# EAGLE design schematic (EAGLE 9.6.2)
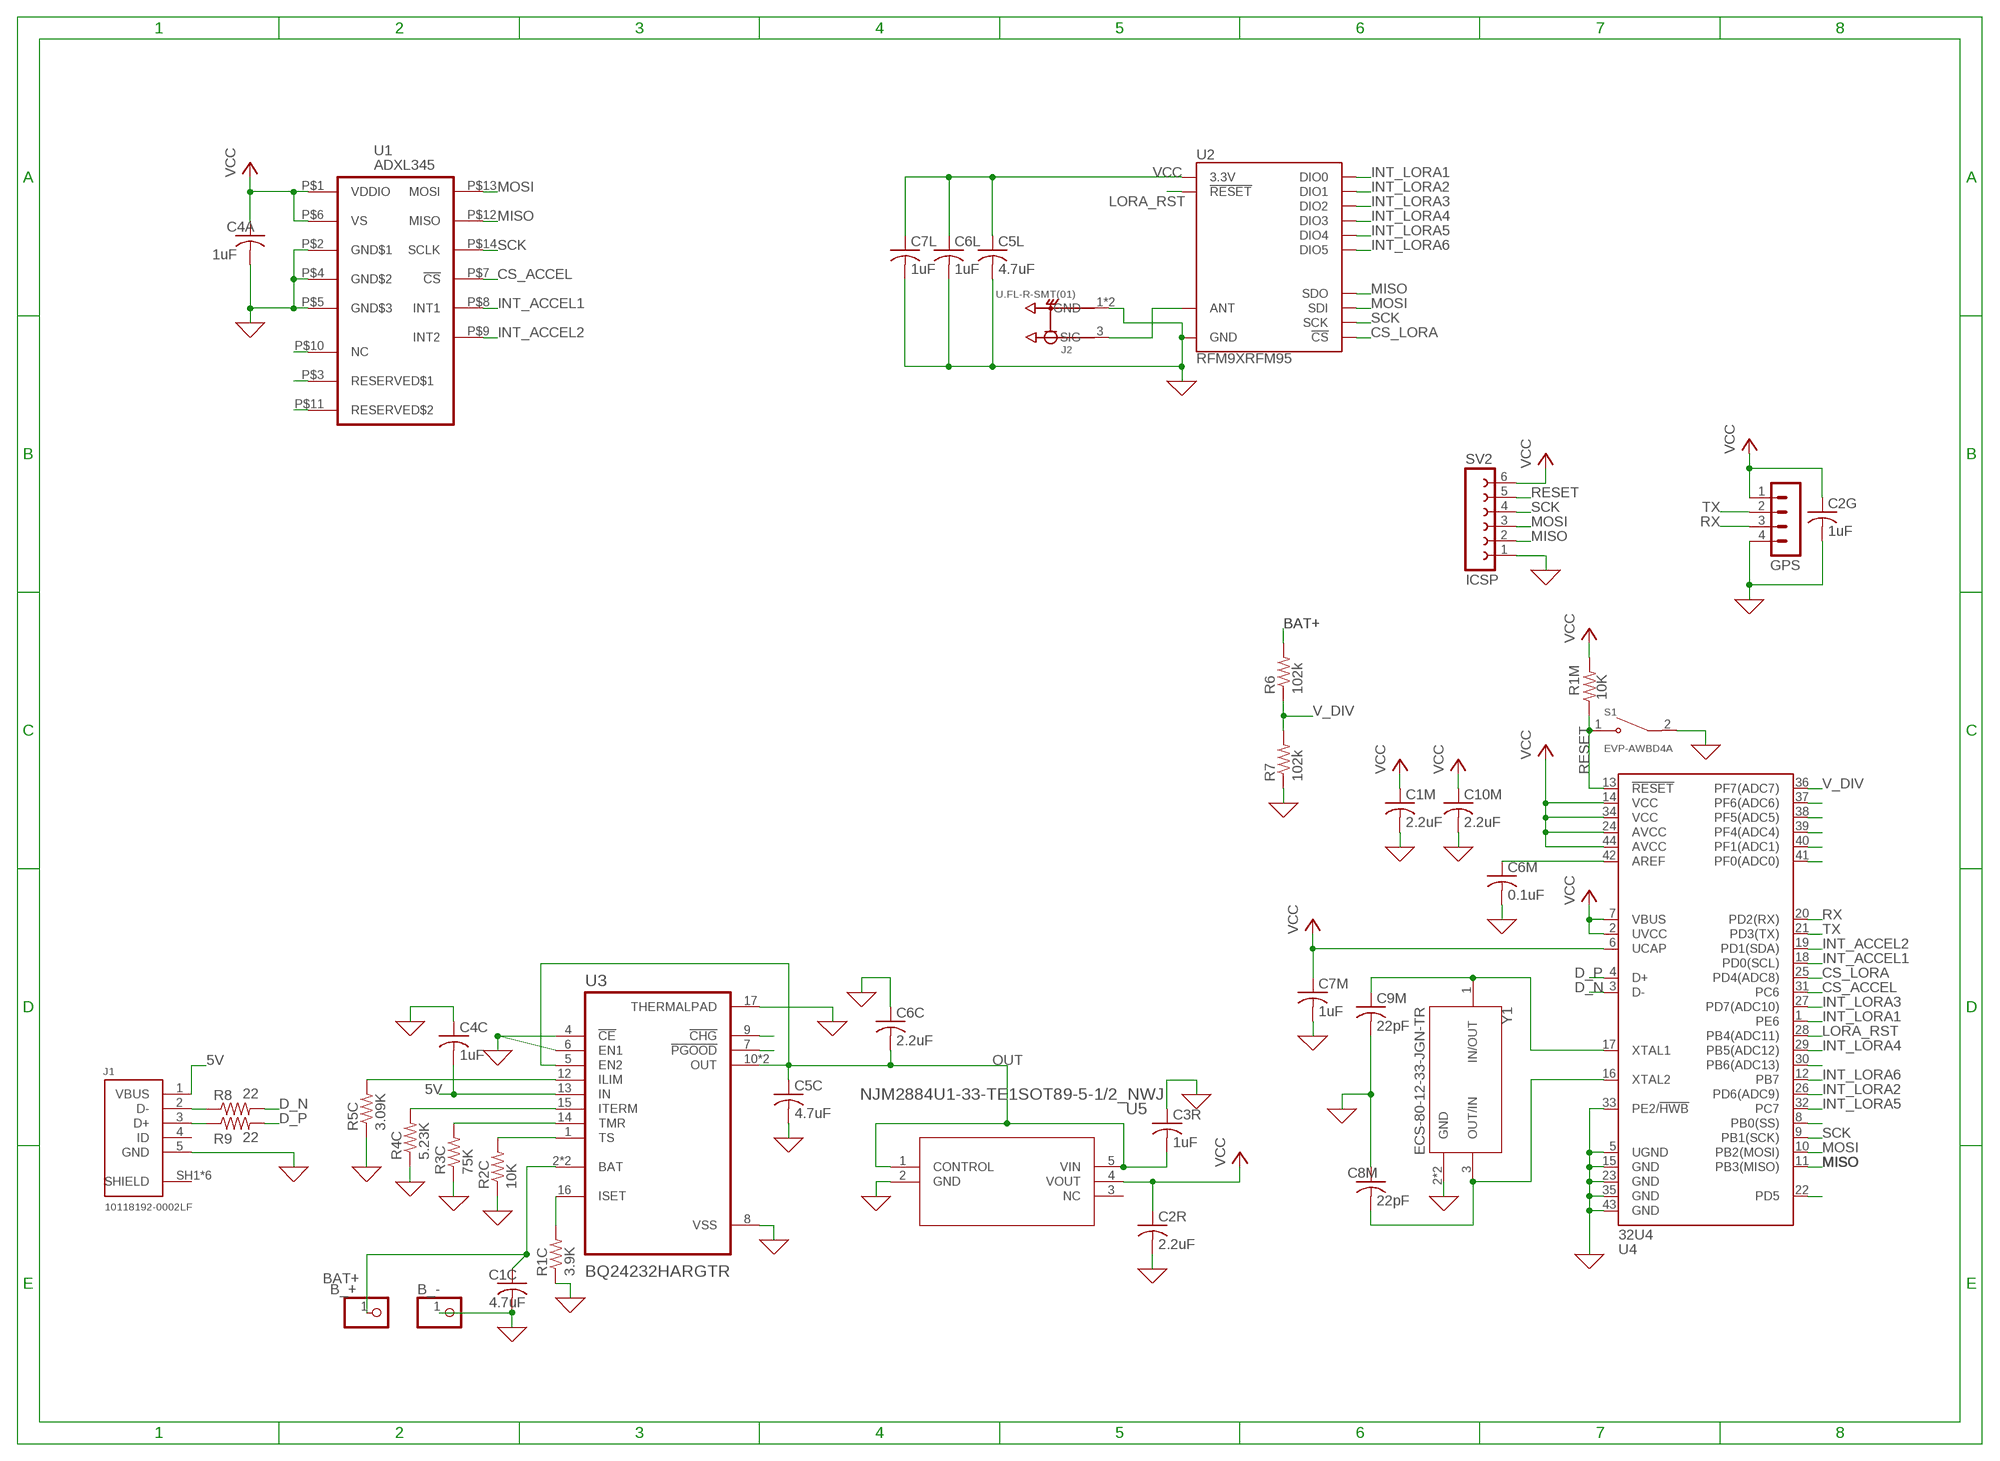
[diagram p0: schematic, sheet 1]

## Parts
B_+  PINHD-1X1  [1X01]
B_-  PINHD-1X1  [1X01]
C1C  4.7uF  C-USC0805  [C0805]
C1M  2.2uF  C-USC0805  [C0805]
C2G  1uF  C-USC0805  [C0805]
C2R  2.2uF  C-USC0805  [C0805]
C3R  1uF  C-USC0805  [C0805]
C4A  1uF  C-USC0805  [C0805]
C4C  1uF  C-USC0805  [C0805]
C5C  4.7uF  C-USC0805  [C0805]
C5L  4.7uF  C-USC0805  [C0805]
C6C  2.2uF  C-USC0805  [C0805]
C6L  1uF  C-USC0805  [C0805]
C6M  0.1uF  C-USC0805  [C0805]
C7L  1uF  C-USC0805  [C0805]
C7M  1uF  C-USC0805  [C0805]
C8M  22pF  C-USC0805  [C0805]
C9M  22pF  C-USC0805  [C0805]
C10M  2.2uF  C-USC0805  [C0805]
GPS  MA04-1  [MA04-1]
J1  10118192-0002LF  [10118192-0002LF]
J2  U.FL-R-SMT(01)  [HRS_U.FL-R-SMT(01)]
R1C  3.9K  R-US_R0805  [R0805]
R1M  10K  R-US_R0805  [R0805]
R2C  10K  R-US_R0805  [R0805]
R3C  75K  R-US_R0805  [R0805]
R4C  5.23K  R-US_R0805  [R0805]
R5C  3.09K  R-US_R0805  [R0805]
R6  102k  R-US_R0805  [R0805]
R7  102k  R-US_R0805  [R0805]
R8  22  R-US_R0805  [R0805]
R9  22  R-US_R0805  [R0805]
S1  EVP-AWBD4A  [SW_EVP-AWBD4A]
SV2  ICSP  FE06-1  [FE06]
U1  ADXL345  [LGA14]
U2  RFM9XRFM95  [RFM95]
U3  BQ24232HARGTR  [QFN50P300X300X100-17N]
U4  32U4  ATMEGA32U4QFN  [QFN-44]
U5  NJM2884U1-33-TE1SOT89-5-1/2_NWJ  [SOT89-5-1/2_NWJ]
Y1  ECS-80-12-33-JGN-TR  [XTAL_ECS-240-8-33-AGN-TR]

## Nets
0 [power]: B_-.1 C1C.2 C1M.2 C2G.2 C2R.2 C3R.1 C4A.2 C4C.1 C5C.2 C5L.2 C6C.1 C6L.2 C6M.2 C7L.2 C7M.2 C8M.1 C9M.2 C10M.2 GPS.4 J1.5(GND) J2.1(GND) J2.2(GND) R1C.1 R2C.1 R3C.1 R4C.1 R5C.1 R7.1 S1.2(COM) SV2.1 U1.P$2(GND$1) U1.P$4(GND$2) U1.P$5(GND$3) U2.GND@1(GND) U2.GND@2(GND) U2.GND@3(GND) U3.4(!CE) U3.6(EN1) U3.8(VSS) U3.17(THERMALPAD) U4.5(UGND) U4.15(GND) U4.23(GND) U4.33(PE2/!HWB) U4.35(GND) U4.43(GND) U5.2(GND) Y1.2(GND) Y1.4(GND) ; supply symbol labelled GND
5V [power]: C4C.2 J1.1(VBUS) U3.13(IN)
BAT+ [power]: B_+.1 C1C.1 R6.2 U3.2(BAT) U3.3(BAT)
CS_ACCEL: U1.P$7(!CS) U4.31(PC6)
CS_LORA: U2.NSS(!CS!) U4.25(PD4(ADC8))
D_N [usb]: R8.2 U4.3(D-)
D_P [usb]: R9.2 U4.4(D+)
INT_ACCEL1: U1.P$8(INT1) U4.18(PD0(SCL))
INT_ACCEL2: U1.P$9(INT2) U4.19(PD1(SDA))
INT_LORA1: U2.DIO0 U4.1(PE6)
INT_LORA2: U2.DIO1 U4.26(PD6(ADC9))
INT_LORA3: U2.DIO2 U4.27(PD7(ADC10))
INT_LORA4: U2.DIO3 U4.29(PB5(ADC12))
INT_LORA5: U2.DIO4 U4.32(PC7)
INT_LORA6: U2.DIO5 U4.12(PB7)
LORA_RST: U2.!RESET U4.28(PB4(ADC11))
MISO: SV2.2 U1.P$12(MISO) U2.SDO U4.11(PB3(MISO))
MOSI: SV2.3 U1.P$13(MOSI) U2.SDI U4.10(PB2(MOSI))
N$1: J1.2(D-) R8.1
N$3: J1.3(D+) R9.1
N$5: R5C.2 U3.12(ILIM)
N$7: R4C.2 U3.15(ITERM)
N$8: U4.37(PF6(ADC6))
N$9: R3C.2 U3.14(TMR)
N$10: U4.38(PF5(ADC5))
N$11: U4.39(PF4(ADC4))
N$12: J2.3(SIG) U2.ANT
N$14: U4.40(PF1(ADC1))
N$15: U4.41(PF0(ADC0))
N$32: U4.30(PB6(ADC13))
N$36: U4.8(PB0(SS))
N$49: U4.22(PD5)
N$50: R2C.2 U3.1(TS)
N$52: R1C.2 U3.16(ISET)
N$55: U3.7(!PGOOD)
N$57: U1.P$10(NC)
N$58: U1.P$3(RESERVED$1)
N$59: U1.P$11(RESERVED$2)
N$63: C8M.2 U4.16(XTAL2) Y1.3(OUT/IN)
N$66: C9M.1 U4.17(XTAL1) Y1.1(IN/OUT)
N$67: C6M.1 U4.42(AREF)
N$68: U3.9(!CHG)
OUT: C3R.2 C5C.1 C6C.2 U3.5(EN2) U3.10(OUT) U3.11(OUT) U5.1(CONTROL) U5.5(VIN)
RESET: R1M.1 S1.1(NO) SV2.5 U4.13(!RESET)
RX: GPS.3 U4.20(PD2(RX))
SCK: SV2.4 U1.P$14(SCLK) U2.SCK U4.9(PB1(SCK))
TX: GPS.2 U4.21(PD3(TX))
V_DIV: R6.1 R7.2 U4.36(PF7(ADC7))
VCC [power]: C1M.1 C2G.1 C2R.1 C4A.1 C5L.1 C6L.1 C7L.1 C7M.1 C10M.1 GPS.1 R1M.2 SV2.6 U1.P$1(VDDIO) U1.P$6(VS) U2.3.3V U4.2(UVCC) U4.6(UCAP) U4.7(VBUS) U4.14(VCC) U4.24(AVCC) U4.34(VCC) U4.44(AVCC) U5.4(VOUT)
Unconnected: J1.4(ID) U5.3(NC)

## Power pins joined to a net without a drawn wire
SHIELD: J1.SH1(SHIELD) J1.SH2(SHIELD) J1.SH3(SHIELD) J1.SH4(SHIELD) J1.SH5(SHIELD) J1.SH6(SHIELD)

## Library data of the parts
B_+ B_- = pinhead:PINHD-1X1: PIN HEADER
C1C C1M C2G C2R C3R C4A C4C C5C C5L C6C C6L C6M C7L C7M C8M C9M C10M = rcl:C-US: CAPACITOR, American symbol; SPICEPREFIX: C
GPS = con-lstb:MA04-1: PIN HEADER; OC_FARNELL: unknown; OC_NEWARK: unknown
J1 = USB connector:10118192-0002LF: CONN RCPT USB2.0 MICRO B SMD R/A Manufacturer's datasheet <https://www.amphenol-icc.com/media/wysiwyg/files/drawing/10118192.pdf>; CREATED_BY: PCBLayout.com; DIGIKEY_PARTNO: 609-5379-2-ND; MANUFACTURER: Amphenol ICC (FCI); MPN: 10118192-0002LF
J2 = U.FL-R-SMT_01_:U.FL-R-SMT(01): U.FL Series 6 Ghz 50 Ohm Ultra-small SMT Coaxial Cable Receptacle Check prices <https://pricing.snapeda.com/parts/U.FL-R-SMT%2801%29/Hirose/view-part?ref=eda>; AVAILABILITY: In Stock; DESCRIPTION: U.FL (UMCC) Connector Receptacle, Male Pin 50Ohm Surface Mount Solder. RF Connectors / Coaxial Connectors; MF: Hirose; MP: U.FL-R-SMT(01); PACKAGE: None; PRICE: None; PURCHASE-URL: https://pricing.snapeda.com/search/part/U.FL-R-SMT(01)/?ref=eda
R1C R1M R2C R3C R4C R5C R6-R9 = rcl:R-US_: RESISTOR, American symbol; SPICEPREFIX: R
S1 = EVP-AWBD4A:EVP-AWBD4A: SWITCH TACTILE SPST-NO 0.02A 15V Buy Part <https://snapeda.com/parts/EVP-AWBD2A/Panasonic/view-part/?ref=eda>; DESCRIPTION: Tactile Switch SPST-NO Top Actuated Surface Mount; DIGI-KEY_PART_NUMBER: P123438TR-ND; MF: Panasonic Electronic Components; MP: EVP-AWBD4A; PACKAGE: None; PURCHASE-URL: https://pricing.snapeda.com/search/part/EVP-AWBD4A/?ref=eda
SV2 = con-lsta:FE06-1: FEMALE HEADER; OC_FARNELL: unknown; OC_NEWARK: unknown
U1 = adxl345:ADXL345: 3-Axis, ±2 g/±4 g/±8 g/±16 g Digital Accelerometer
U2 = SparkFun-RF:RFM9X: RFM95/96/97/98 The RFM95/96/97/98(W) transceivers feature the LoRaTM long range modem that provides ultra-long range spread spectrum communication and high interference immunity whilst minimising current consumption. These devices also support high performance (G)FSK modes for systems including WMBus, IEEE802.15.4g. The RFM95/96/97/98(W) deliver exceptional phase noise, selectivity, receiver linearity and IIP3 for significantly lower current consumption than competing devices Datasheet <http://www.hoperf.com/upload/rf/RFM95_96_97_98W.pdf>; PROD_ID: IC-13959
U3 = BQ24232HARGTR:BQ24232HARGTR; DESCRIPTION: USB Friendly 0.5A Li-ion charger with power-Path, 10.5V OVP 16-VQFN -5 to 125; DIGI-KEY_PART_NUMBER: 296-49554-1-ND; MF: Texas Instruments; MP: BQ24232HARGTR; PACKAGE: VQFN-16 Texas Instruments; PURCHASE-URL: https://pricing.snapeda.com/search/part/BQ24232HARGTR/?ref=eda
U4 = SparkFun-IC-Microcontroller:ATMEGA32U4: Atmel MCU, 32KByte Atmel 44-pin 8-bit Microcontroller with 32KBytes of ISP Flash and USB Controller Datasheet <http://cdn.sparkfun.com/datasheets/Dev/Arduino/Boards/ATMega32U4.pdf> SparkFun Products LilyPad Arduino USB - ATmega32U4 Board <https://www.sparkfun.com/products/12049> (DEV-12049) Pro Micro - 5V/16MHz <https://www.sparkfun.com/products/12640> (DEV-12640) Pro Micro - 3.3V/8MHz <https://www.sparkfun.com/products/12587> (DEV-12587) Fio v3 - ATmega32U4 <https://www.sparkfun.com/products/11520> (DEV-11520) Qduino Mini <https://www.sparkfun.com/products/13614> (DEV-13614) Makey Makey - Standard Kit <https://www.sparkfun.com/products/11511> (WIG-11511) Makey Makey Deluxe Kit <https://www.sparkfun.com/products/11519> (WIG-11519); PROD_ID: IC-10828
U5 = 2021-10-22_20-54-43_Library:NJM2884U1-33-TE1; COPYRIGHT: Copyright (C) 2021 Ultra Librarian. All rights reserved.; DIGI-KEY_PART_NUMBER_1: 190-NJM2884U1-33-TE1TR-ND; DIGI-KEY_PART_NUMBER_2: 190-NJM2884U1-33-TE1CT-ND; DIGI-KEY_PART_NUMBER_3: 190-NJM2884U1-33-TE1DKR-ND; MANUFACTURER_PART_NUMBER: NJM2884U1-33-TE1; MFR_NAME: New Japan Radio
Y1 = CRYSTAL-ECS-80-12-33-JGN-TR:ECS-80-12-33-JGN-TR: The sub miniature ECX-32 is a compact SMD Crystal. The 3.2 x 2.5 x 0.8 mm ceramic package is ideal for today’s SMD manufacturing environment.; DESCRIPTION: 8MHz ±20ppm Crystal 12pF 400 Ohms 4-SMD, No Lead; MF: ECS Inc.; MP: ECS-80-12-33-JGN-TR; PACKAGE: SMD-4 ECS International; PURCHASE-URL: https://pricing.snapeda.com/search/part/ECS-80-12-33-JGN-TR/?ref=eda

## Net classes
1 power: width 0.203 mm, clearance 0.152 mm
2 usb: width 0.152 mm

## Board
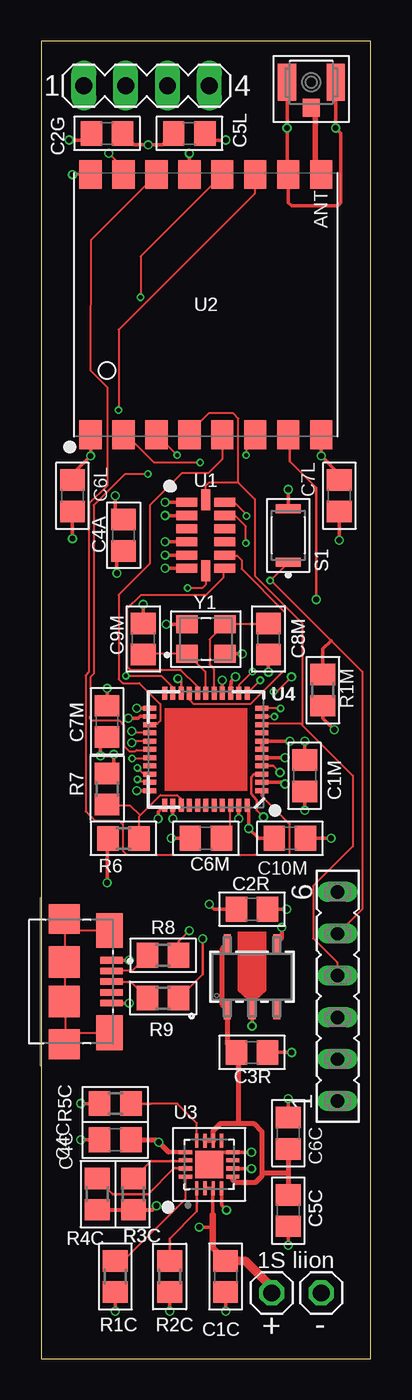
[diagram p1: board, top side]
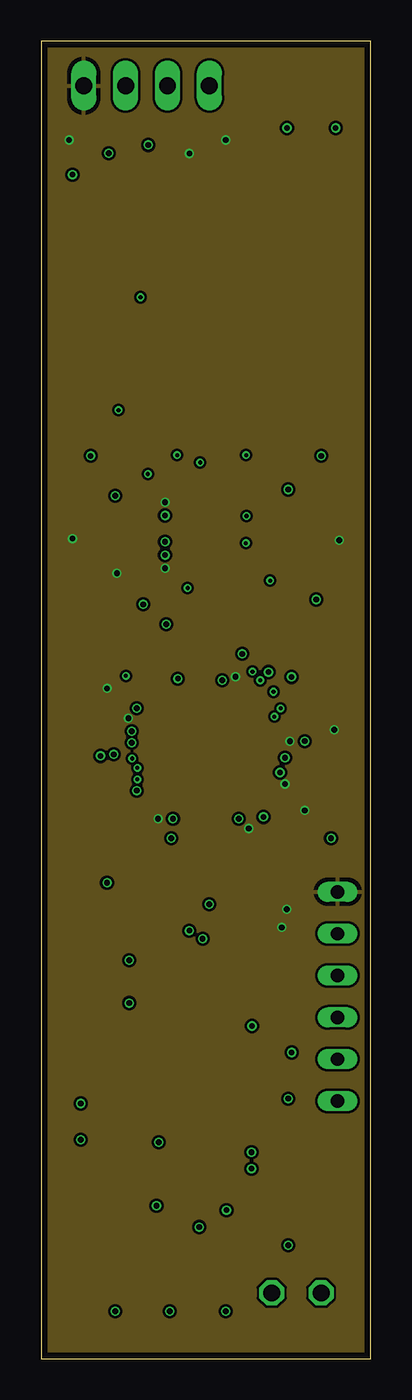
[diagram p2: board, inner layer Route2]
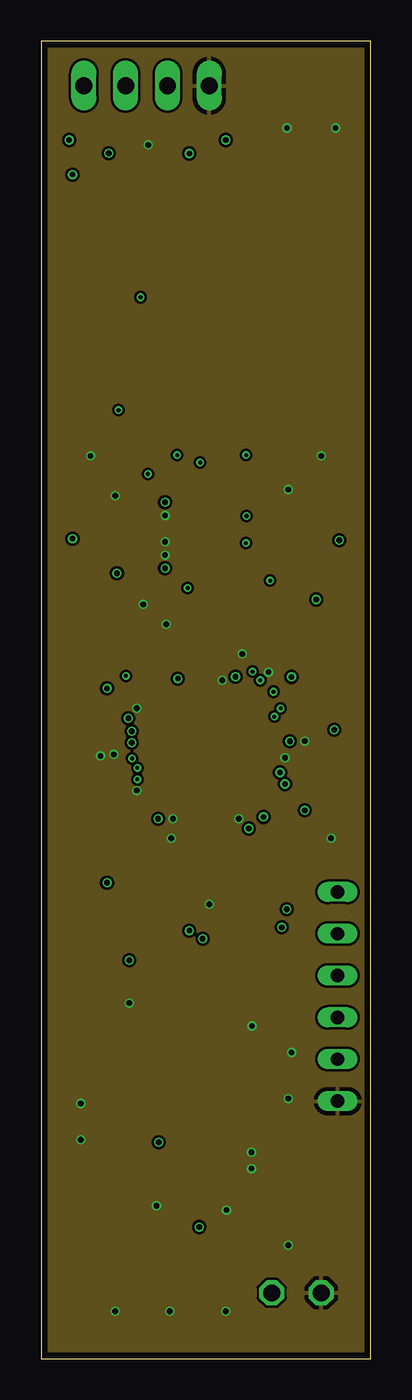
[diagram p3: board, inner layer Route15]
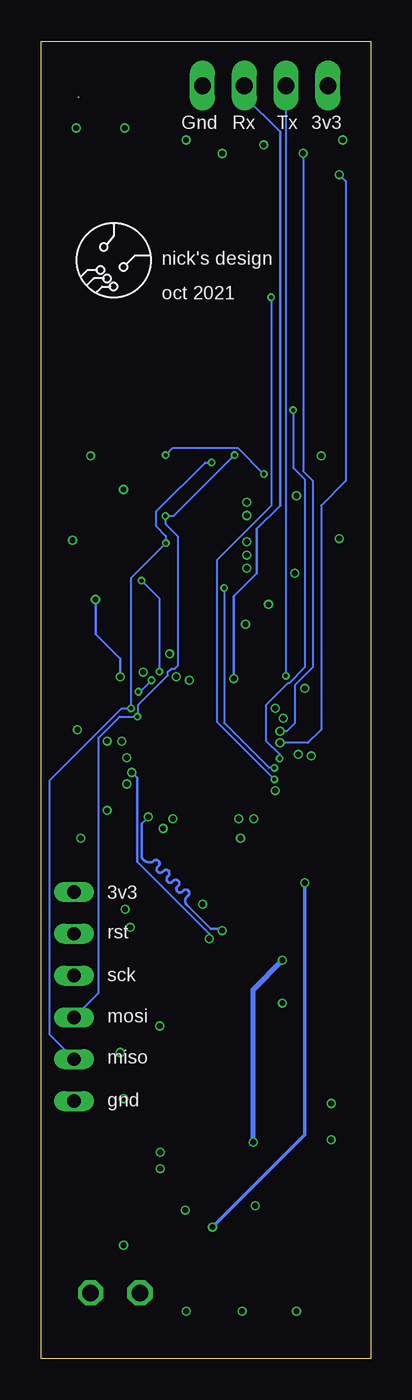
[diagram p4: board, bottom side, seen from below]

Size 20 x 80 mm. Coordinates in mm from the lower left corner, seen from the top.
Outline: 0,0 20,0 20,80 0,80 0,0
Copper layers (1*2*15*16): Top 0.035559375mm / dielectric 0.17018125mm / Route2 0.01778125mm / dielectric 47mil / Route15 0.01778125mm / dielectric 0.17018125mm / Bottom 0.035559375mm
Design rules "oshpark-4layer": minimum track width 5mil, minimum drill 10mil, track to track 5mil, track to pad 5mil, pad to pad 5mil, via to via 5mil, smd to smd 5mil, copper to edge 15mil, drill to drill 6mil, minimum pad ring 4mil, minimum via ring 4mil, stop-mask expansion 1.5mil, vias tented up to drill 0mil, thermal gap 10mil

### Footprints (pad centres in the part's own frame; a part is rotated, then mirrored left to right if it is on the bottom)
1X01 = drill 1.016 octagon: 1 0,0
C0805 = smd 1.3 x 1.5: 1 -0.95,0; 2 0.95,0
MA04-1 = drill 1.016 long: 1 -3.81,0; 2 -1.27,0; 3 1.27,0; 4 3.81,0
10118192-0002LF = smd 0.4 x 1.35: 1 -1.3,2.875; 2 -0.65,2.875; 3 0,2.875; 4 0.65,2.875; 5 1.3,2.875 | smd 2.1 x 1.6: SH1 -3.1,2.75; SH2 3.1,2.75 | smd 1.8 x 1.9: SH3 -3.8,0; SH4 3.8,0 | smd 1.9 x 1.9: SH5 -1.2,0; SH6 1.2,0
HRS_U.FL-R-SMT(01) = smd 1.1 x 2.25: 1 -1.475,0; 2 1.475,0 | smd 1.05 x 1.1: 3 0,-1.55
R0805 = smd 1.3 x 1.5: 1 -0.95,0; 2 0.95,0
SW_EVP-AWBD4A = smd 0.55 x 1.5: 1 -1.625,0; 2 1.625,0
FE06 = drill 0.813 long: 1 -6.35,0; 2 -3.81,0; 3 -1.27,0; 4 1.27,0; 5 3.81,0; 6 6.35,0
LGA14 = smd 1.277 x 0.55: P$1 -1.156,2; P$2 -1.156,1.2; P$3 -1.156,0.4; P$4 -1.156,-0.4; P$5 -1.156,-1.2; P$6 -1.156,-2; P$8 1.156,-2; P$9 1.156,-1.2; P$10 1.156,-0.4; P$11 1.156,0.4; P$12 1.156,1.2; P$13 1.156,2 | smd 0.55 x 1.277: P$7 0,-2.156; P$14 0,2.156
RFM95 = smd 1.75 x 1.35: 3.3V 7.9,1; !RESET -7.9,-3; ANT 7.9,-7; DIO0 7.9,3; DIO1 7.9,5; DIO2 7.9,7; DIO3 7.9,-3; DIO4 7.9,-1; DIO5 -7.9,-5; GND@1 -7.9,7; GND@2 -7.9,-7; GND@3 7.9,-5; NSS -7.9,-1; SCK -7.9,1; SDI -7.9,3; SDO -7.9,5
QFN50P300X300X100-17N = smd 0.86 x 0.26: 1 -1.435,0.75; 2 -1.435,0.25; 3 -1.435,-0.25; 4 -1.435,-0.75; 9 1.435,-0.75; 10 1.435,-0.25; 11 1.435,0.25; 12 1.435,0.75 | smd 0.26 x 0.86: 5 -0.75,-1.435; 6 -0.25,-1.435; 7 0.25,-1.435; 8 0.75,-1.435; 13 0.75,1.435; 14 0.25,1.435; 15 -0.25,1.435; 16 -0.75,1.435 | smd 1.68 x 1.68: 17 0,0
QFN-44 = smd 0.8 x 0.3: 1 -3.4,2.5; 2 -3.4,2; 3 -3.4,1.5; 4 -3.4,1; 5 -3.4,0.5; 6 -3.4,0; 7 -3.4,-0.5; 8 -3.4,-1; 9 -3.4,-1.5; 10 -3.4,-2; 11 -3.4,-2.5; 23 3.4,-2.5; 24 3.4,-2; 25 3.4,-1.5; 26 3.4,-1; 27 3.4,-0.5; 28 3.4,0; 29 3.4,0.5; 30 3.4,1; 31 3.4,1.5; 32 3.4,2; 33 3.4,2.5 | smd 0.3 x 0.8: 12 -2.5,-3.4; 13 -2,-3.4; 14 -1.5,-3.4; 15 -1,-3.4; 16 -0.5,-3.4; 17 0,-3.4; 18 0.5,-3.4; 19 1,-3.4; 20 1.5,-3.4; 21 2,-3.4; 22 2.5,-3.4; 34 2.5,3.4; 35 2,3.4; 36 1.5,3.4; 37 1,3.4; 38 0.5,3.4; 39 0,3.4; 40 -0.5,3.4; 41 -1,3.4; 42 -1.5,3.4; 43 -2,3.4; 44 -2.5,3.4
SOT89-5-1/2_NWJ = smd 0.432 x 1.194: 1 -1.5,-1.994; 3 1.5,-1.994; 4 1.5,1.994; 5 -1.5,1.994 | smd 0.483 x 1.194: 2 0,-1.994
XTAL_ECS-240-8-33-AGN-TR = smd 1.3 x 1.1: 1 -1.15,-0.9; 2 1.15,-0.9; 3 1.15,0.9; 4 -1.15,0.9

### Placement (x,y rotation side)
B_+  14,4 0 top
B_-  17,4 0 top
C1C  11.2,5 270 top
C1M  16,35.4 90 top
C2G  4,74.4 0 top
C2R  12.8,27.3 180 top
C3R  12.8,18.6 180 top
C4A  5,50 90 top
C4C  4.5,13.3 0 top
C5C  15,9 270 top
C5L  9,74.4 180 top
C6C  15,13.7 270 top
C6L  1.9,52.4 90 top
C6M  10,31.6 180 top
C7L  18.1,52.4 90 top
C7M  4,38.7 270 top
C8M  13.8,43.7 90 top
C9M  6.2,43.7 90 top
C10M  15.1,31.6 0 top
GPS  6.4,77.3 0 top
J1  1.4,22.9 270 top
J2  16.4,77.5 0 top
R1C  4.5,5 90 top
R1M  17.1,40.6 270 top
R2C  7.8,5 90 top
R3C  5.6,10 90 top
R4C  3.4,10 90 top
R5C  4.5,15.5 0 top
R6  5,31.59 180 top
R7  4,34.6 270 top
R8  7.4,24.5 0 top
R9  7.4,21.9 0 top
S1  15,50 90 top
SV2  18,22 90 top
U1  10,50 0 top
U2  10,64 90 top
U3  10.2,11.8 90 top
U4  10,37 180 top
U5  12.8,23.2 0 top
Y1  10,43.7 0 top

### Tracks (layer width: path | path; a pad name or v marks a point on that pad's centre or on a via)
0  (via drill 0.35)
  Top 0.203: S1.2 v15,52.78 | Y1.2 v12.2,42.8 | C6M.2 v7.9,31.6 | C1C.2 v11.2,2.9 | C9M.2 v6.2,45.8 | C8M.1 v13.8,41.7 | R5C.1 v2.4,15.5 | C5C.2 v15,6.9 | R2C.1 v7.8,2.9 | J2.1 v14.93,74.73 14.93,71.97 U2.GND@3 15,70.2 15.2,70 18,70 18.2,70.2 18.2,74.4 v17.88,74.73 J2.2 | R1C.1 v4.5,2.9 | v15.2,18.6 C3R.1 | R7.1 4.4,35.95 v4.4,36.7 4.31,36.6 v3.6,36.6 3.6,37.35 C7M.2 | J1.5 v5.35,21.6 | v12.77,12.55 U3.8 10.95,12.55 U3.17 | U3.4 10.95,9.33 v11.25,9.03 | U5.2 v12.8,20.21 | U2.GND@1 v3,54.82 1.9,53.72 C6L.2 | U2.GND@2 v17,54.82 18.1,53.72 C7L.2 | U4.33 v5.8,34.5 | C5L.2 7.35,73.7 v6.5,73.7 5.65,73.7 C2G.2 | U1.P$5 v7.52,48.8 | U4.23 v5.8,39.5 | U4.5 v14.8,36.5 | U4.43 v12,32.8 | U4.35 v8,32.8 | U4.15 v11,41.2 | Y1.4 v7.6,44.6 | C1M.2 v16,37.5 | U1.P$2 v7.52,51.2 | U1.P$4 v7.52,49.6 | C4A.2 4.5,51.45 v4.5,52.4 | 11.35,27.8 C2R.2 10.5,27.3 v10.2,27.6 | v12.77,11.55 U3.6 | C6C.1 v15,15.8 | C10M.2 v17.6,31.6 | C4C.1 v2.4,13.3
  Top 0.254: R4C.1 R3C.1 6.75,9.05 v7,9.3
  pour Route15: -5,-4 24,-4 24,84 -5,84
5V  (via drill 0.35)
  Top 0.203: J1.1 v5.35,24.2
  Top 0.254: U3.13 7.73,12.55
  Top 0.305: C4C.2 6.98,13.3 v7.13,13.15 7.73,12.55
  Bottom 0.305: v5.35,24.2 7.14,22.42 v7.14,13.16 v7.13,13.15
BAT+  (via drill 0.35)
  Top 0.203: U3.2 9.97,10.35 10.41,10.35 U3.3 10.41,10.29 10.41,8.75 | 11.18,5.97 C1C.1 | R6.2 4.06,31.56 4,31.5 v4,28.9 | 10.41,8 v9.6,8
  Top 0.406: 10.41,8.75 10.41,8 10.41,6.73 11.18,5.97
  Top 0.508: C1C.1 12.39,5.95 13.97,4.38 13.97,4 B_+.1
  Bottom 0.203: v9.6,8 4,13.6 v4,28.9
CS_ACCEL  (via drill 0.25)
  Top 0.127: v5.84,35.88 6.16,35.56 6.54,35.56 U4.31 | U1.P$7 10,47.01 9.79,46.8 v8.89,46.8
  Bottom 0.127: v5.84,35.88 6.16,35.88 8.89,38.61 v8.89,46.8
CS_LORA
  Top 0.127: U4.25 6.6,38.54 7.05,38.54 7.24,38.73 7.24,39.75 5.97,41.02 4.95,41.02 4.7,41.27 4.7,46.39 6.59,48.28 6.59,51.83 8.54,53.77 10.14,53.77 10.99,54.62 10.99,56.07 U2.NSS
D_N  (via drill 0.35)
  Top 0.152: R8.2 8.35,25.35 v9,26 | v13.5,32.9 13.1,33.3 13.1,33.9 12.75,34.3 12.75,35.3 12.9,35.5 U4.3
  Bottom 0.152: v13.5,32.9 13.9,32.5 13.9,30.54 arc-45 13.8,30.3 arc-64 13.23,30.17 13.2,30.2 arc199 12.9,29.9 arc-199 12.6,29.6 arc199 12.3,29.3 arc-199 12,29 arc199 11.7,28.7 arc-199 11.4,28.4 arc199 11.1,28.1 arc-99 11.15,27.54 9.7,26.1 9.1,26.1 v9,26
D_P  (via drill 0.35)
  Top 0.152: R9.2 9.8,23.35 v9.8,25.5 | v14.5,35.6 14.1,36 U4.4
  Bottom 0.152: v9.8,25.5 9.8,25.8 14.18,30.18 14.18,35.28 v14.5,35.6
INT_ACCEL1
  Top 0.127: U4.18 9.46,40.45 9.46,40.83 8.45,41.85 5.4,41.85 5.21,42.04 5.21,45.53 6.03,46.35 9.99,46.35 11.05,47.42 11.05,47.94 U1.P$8
INT_ACCEL2
  Top 0.127: U4.19 9.02,40.39 9.02,40.01 9.27,39.75 12.7,39.75 14.8,41.85 14.8,45.34 12.18,47.96 12.18,48.49 11.89,48.77 11.11,48.77 U1.P$9
INT_LORA1
  Top 0.127: 2.9,43 2.9,51.92 4,53.02 4,59 2.99,60.01 3.02,67.92 6.99,71.88 U2.DIO0 | 2.9,43 2.9,41.7 2.7,41.5 2.7,33.24 3.27,32.67 4.74,32.67 4.95,32.45 4.95,30.86 5.21,30.61 15.1,30.61 15.1,32.47 13.4,34.16 U4.1 | 2.9,43
INT_LORA2  (via drill 0.35)
  Top 0.127: U4.26 5.6,38 v5.5,38.1 | U2.DIO1 5,72.3 v4.1,73.2
  Bottom 0.127: v4.1,73.2 4.1,53.9 3.5,53.3 3.5,42 4.6,40.9 4.6,38.6 5.1,38.1 v5.5,38.1
INT_LORA3  (via drill 0.35)
  Top 0.127: v5.5,37.4 5.6,37.5 U4.27 | U2.DIO2 v1.9,71.9
  Bottom 0.127: v1.9,71.9 1.5,71.5 1.5,53.3 3,51.8 3,38.2 3.8,37.4 v5.5,37.4
INT_LORA4  (via drill 0.25)
  Top 0.127: v5.52,36.45 6.54,36.45 U4.29 | v4.7,57.59 4.7,62.48 12.95,70.74 12.95,71.88 U2.DIO3
  Bottom 0.127: v5.52,36.45 5.52,36.7 6.35,37.53 6.35,39.69 5.02,41.02 4.95,41.02 4,41.97 4,53.4 4.7,54.1 v4.7,57.59
INT_LORA5  (via drill 0.25)
  Top 0.127: v5.84,35.18 5.97,35.05 6.54,35.05 U4.32 | v6.03,64.45 6.03,66.93 10.99,71.88 U2.DIO4
  Bottom 0.127: v5.84,35.18 9.34,38.67 9.34,48.49 6.03,51.79 v6.03,64.45
INT_LORA6  (via drill 0.25, 0.35)
  Top 0.152: U2.DIO5 15.1,56 15.1,54.5 16.7,52.9 v16.7,46.1 | v15.2,41.4 14.3,40.5 v14.1,40.5 | v13.3,41.2 U4.12
  Bottom 0.152: v16.7,46.1 16.7,44 15.2,42.5 v15.2,41.4 | v14.1,40.5 14,40.5 v13.3,41.2
LORA_RST  (via drill 0.25)
  Top 0.127: 2.98,39 2.98,38.85 3.1,38.73 4.76,38.73 5.02,38.48 5.02,37.21 5.33,36.89 5.71,36.89 5.78,36.96 6.54,36.96 U4.28 | 2.98,39 2.98,41.38 3.2,41.6 3.18,51.83 5.08,53.72 v6.48,53.72 | v12.45,54.86 12.45,55.56 12.95,56.07 U2.!RESET | 2.98,39
  Bottom 0.127: v6.48,53.72 8.06,55.31 12,55.31 v12.45,54.86
MISO  (via drill 0.25)
  Top 0.127: v14.54,39.5 13.46,39.5 U4.11 | v12.43,49.52 12.43,50.55 11.79,51.18 11.11,51.18 U1.P$12 | v9.65,54.42 6.86,54.42 5.21,56.07 5.02,56.07 U2.SDO
  Bottom 0.127: SV2.2 18.03,18.22 19.49,19.68 19.49,35.12 15.11,39.5 v14.54,39.5 14.54,47.41 v12.43,49.52 12.43,49.96 13.01,50.54 13.01,51.46 10.05,54.42 v9.65,54.42
MOSI  (via drill 0.25)
  Top 0.127: v14.16,38.99 13.46,38.99 U4.10 | v12.46,51.17 12.46,51.27 11.79,51.94 11.11,51.94 U1.P$13 | v8.26,54.86 7.05,56.07 U2.SDI
  Bottom 0.127: SV2.3 17.97,20.77 16.51,22.23 16.51,37.72 15.24,38.99 v14.16,38.99 14.1,39.05 14.1,39.72 12.7,41.1 12.3,41.5 12.3,41.7 12.1,41.9 11.9,41.9 11.68,42.12 11.68,49.91 12.46,50.69 v12.46,51.17 11.96,51.17 8.27,54.86 v8.26,54.86
N$1
  Top 0.127: J1.2 4.32,23.56 5.52,23.56 6.41,24.45 R8.1
N$3
  Top 0.127: J1.3 4.32,22.86 5.46,22.86 6.41,21.91 R9.1
N$5
  Top 0.127: U3.12 9.45,14.31 8.27,15.49 6.67,15.49
  Top 0.152: 6.67,15.49 6.66,15.5 R5C.2
N$7
  Top 0.127: U3.15
  Top 0.152: R4C.2 4.35,10 6.5,10 8.06,11.56 U3.15
N$9
  Top 0.127: 8.76,12 U3.14
  Top 0.152: R3C.2 6.65,12 8.76,12
N$12
  Top 0.127: 16.65,75.93 J2.3
  Top 0.254: U2.ANT 16.65,72.25
  Top 0.337: 16.65,72.25 16.65,75.93
N$50
  Top 0.152: R2C.2 7.8,7.3 9.45,8.95 U3.1
N$52
  Top 0.127: R1C.2 4.99,5.95 8.76,9.72 U3.16
N$63
  Top 0.127: U4.16 10.48,40.45 10.48,41.91 10.22,42.16 10.22,43.69 11.11,44.58 Y1.3 11.18,44.64 13.78,44.64 C8M.2
N$66
  Top 0.127: U4.17 9.97,40.45 9.97,41.72 8.89,42.8 Y1.1 8.83,42.8 6.22,42.8 C9M.1
N$67
  Top 0.127: U4.42 11.49,32.13 10.99,31.62 C6M.1
OUT
  Top 0.305: U5.5 11,24.89 11,21.51 U5.1 11.3,19.15 C3R.2 12,18.45 12,14.3 | C6C.2 15,11.3 | 15,11.3 C5C.1 | 12,14.3 10.9,14.3 10.45,13.85 U3.10 U3.11 | 12,14.3 12.9,14.3 13.4,13.8 13.4,11.3 | 13.4,11.3 13.4,11.1 13,10.7 11.8,10.7 11.63,10.87 U3.5 | 13.4,11.3 15,11.3
RESET  (via drill 0.25)
  Top 0.127: v12.83,41.72 12,40.89 12,40.45 U4.13 | S1.1 14.99,48.32 v13.91,47.24 13.97,47.24 17.61,43.61 19.49,41.72 19.49,27.3 SV2.5
  Top 0.203: R1M.1 17.1,43.1 17.61,43.61
  Bottom 0.127: v12.83,41.72 12.83,46.16 v13.91,47.24
RX  (via drill 0.35)
  Top 0.152: U4.20 8.5,41.3 v8.3,41.3
  Bottom 0.152: v8.3,41.3 8.3,46.3 6.9,47.7 6.9,50.4 5.5,51.8 5.5,74.5 7.67,76.67 GPS.3
SCK
  Top 0.127: 15.85,38.48 15.78,38.54 13.46,38.54 U4.9 | 15.85,38.48 15.85,44.67 12.97,47.54 12.97,52.19 11.97,53.19 11.97,53.22 | 11.97,53.22 10.21,53.22 10,53 U1.P$14 | U2.SCK 9,56.23 10.19,57.41 11.65,57.41 11.97,57.09 11.97,53.22 | 15.85,38.48 18.92,35.41 18.92,31.12 16.51,28.71 16.51,25.53 17.97,24.07 17.97,23.3 SV2.4
SHIELD
  Top 0.127: 1.46,19.81 1.46,21.65 J1.SH6 1.46,21.72 1.46,24.07 J1.SH5 1.46,24.13 1.46,26.04 | 1.46,19.81 1.46,19.11 J1.SH4 1.46,19.81 | 1.46,26.04 1.46,26.67 J1.SH3 1.46,26.04 | 1.46,19.81 4.13,19.81 J1.SH2 | 1.46,26.04 4.13,26.04 J1.SH1
TX  (via drill 0.25)
  Top 0.127: v5.14,41.47 7.3,41.47 7.94,40.83 7.94,40.45 U4.21
  Bottom 0.127: v5.14,41.47 5.14,77.28 GPS.2
V_DIV
  Top 0.127: 6,32.99 5.97,32.96 5.97,31.62 R6.1 | 6,32.99 7.24,34.23 8.26,34.23 8.45,34.04 8.45,33.66 U4.36 | 6,32.99 5.4,33.59 4,33.59 R7.2
VCC  (via drill 0.35)
  Top 0.203: C2R.1 v14.9,27.3 | C7M.1 v4,40.7 | U2.3.3V v9,73.18 | U4.24 6,39 5.9,38.9 v5.3,38.9 | v15.1,37.5 U4.7 U4.6 | U4.44 12.6,33.5 v12.6,32.2 13.2,31.6 C10M.1 | U4.34 7.1,33.2 v7.1,32.8 | v11.2,74 10.35,74 C5L.1 | U1.P$1 v7.52,52 | C2G.1 2.65,74 v1.7,74 | C1M.1 v16,33.3 | v14.8,34.9 14.7,35 U4.2 | U1.P$6 v7.52,48 | C4A.1 4.6,48.65 v4.6,47.7 | C6L.1 v1.9,49.8 | C7L.1 v18.1,49.7 | R1M.2 17.1,38.9 v17.8,38.2 | v11.8,41.4 11.53,41.13 11.53,40.98 11.5,40.95 U4.14
  Top 0.254: U5.4 14.6,25.49 v14.6,26.19
  pour Route2: -3,-2 22,-2 22,82 -3,82

### Text on the board
tPlace: + | -
bPlace: 3v3 | Tx | Rx | Gnd | nick's design | oct 2021 | 3v3 | rst | sck | mosi | miso | gnd
tNames: 1S liion
_tNames: C5L | C2G | U2 | U1 | C4A | S1 | Y1 | C9M | C8M | U4 | C7M | R7 | C1M | R6 | C6M | C2R | R8 | R9 | C3R | U3 | C4C | R5C | C5C | R3C | R4C | R1C | R2C | C1C